# Altium schematic sheet Controle Moteurs.SchDoc
size A4
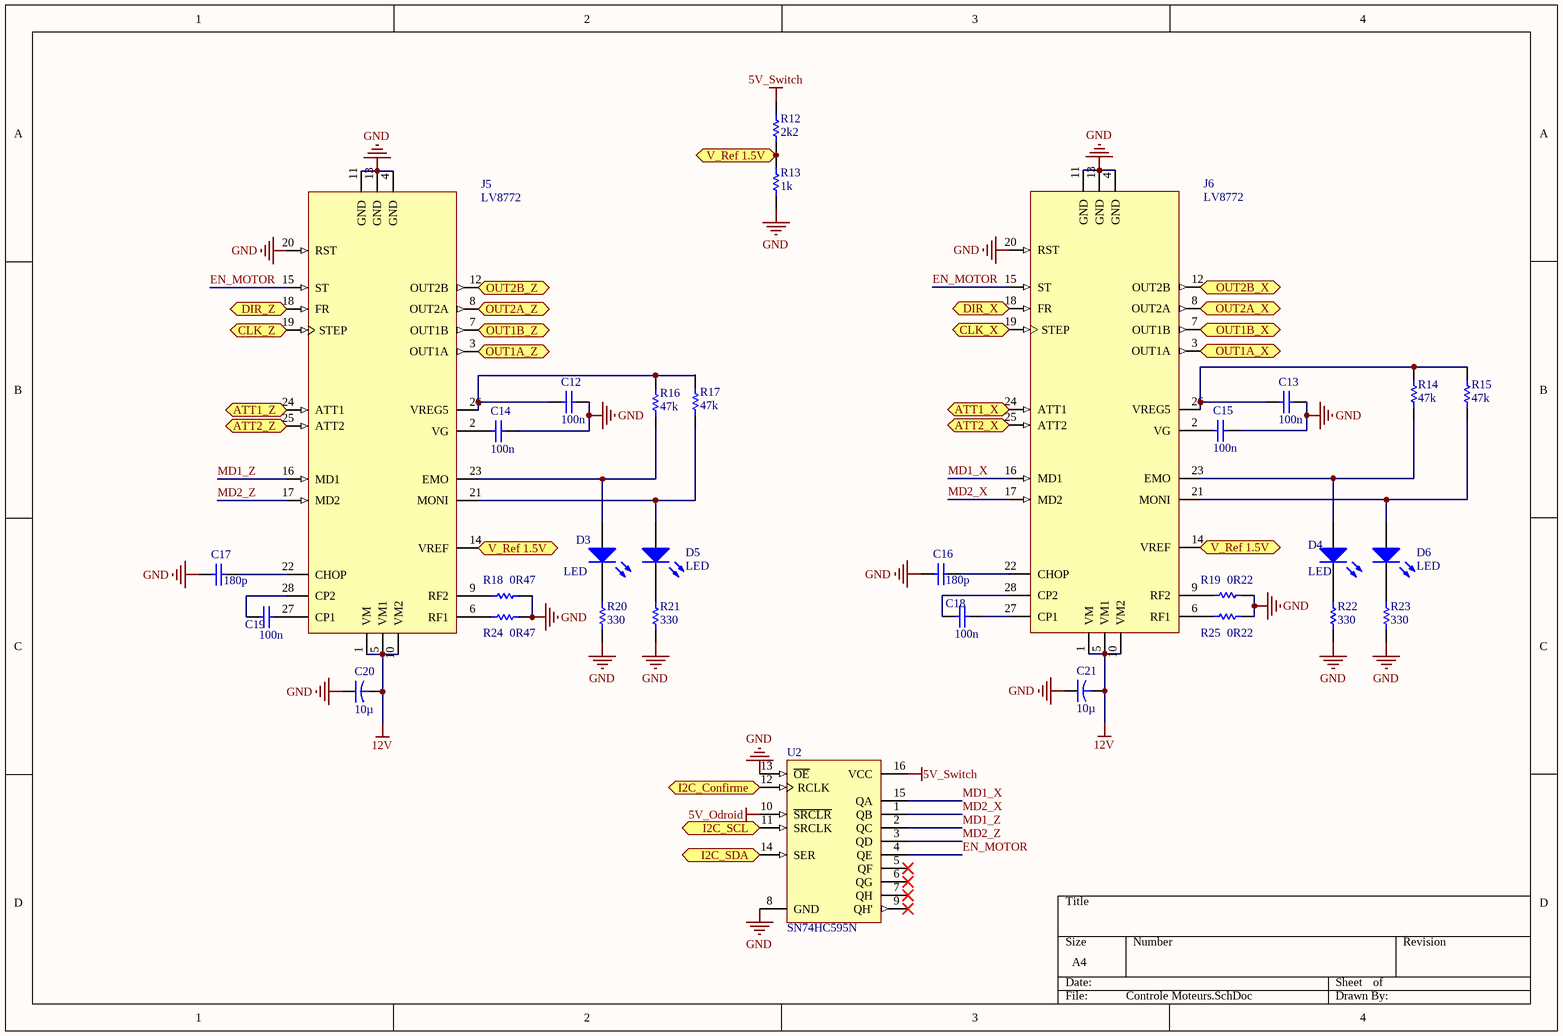
[diagram p0: Controle Moteurs.SchDoc]

## Parts
C12  value 100n  [0805]  (hidden comment: Cap)
C13  value 100n  [0805]  (hidden comment: Cap)
C14  value 100n  [0805]  (hidden comment: Cap)
C15  value 100n  [0805]  (hidden comment: Cap)
C16  value 180p  [0805]  (hidden comment: Cap)
C17  value 180p  [0805]  (hidden comment: Cap)
C18  value 100n  [0805]  (hidden comment: Cap)
C19  value 100n  [0805]  (hidden comment: Cap)
C20  value 10µ  [CAPR5-4X5]  (hidden comment: Cap2)
C21  value 10µ  [CAPR5-4X5]  (hidden comment: Cap2)
D3  LED  [C0805]
D4  LED  [C0805]
D5  LED  [C0805]
D6  LED  [C0805]
J5  LV8772  [DIP-28/P1.78]
J6  LV8772  [DIP-28/P1.78]
R12  value 2k2  [0805]  (hidden comment: Res*)
R13  value 1k  [0805]  (hidden comment: Res*)
R14  value 47k  [0805]  (hidden comment: Res*)
R15  value 47k  [0805]  (hidden comment: Res*)
R16  value 47k  [0805]  (hidden comment: Res*)
R17  value 47k  [0805]  (hidden comment: Res*)
R18  value 0R47  [0805]  (hidden comment: Res*)
R19  value 0R22  [0805]  (hidden comment: Res*)
R20  value 330  [0805]  (hidden comment: Res*)
R21  value 330  [0805]  (hidden comment: Res*)
R22  value 330  [0805]  (hidden comment: Res*)
R23  value 330  [0805]  (hidden comment: Res*)
R24  value 0R47  [0805]  (hidden comment: Res*)
R25  value 0R22  [0805]  (hidden comment: Res*)
U2  SN74HC595N  [SOIC-SO16_M]

## Ports
ATT1_X, ATT1_Z, ATT2_X, ATT2_Z, CLK_X, CLK_Z, DIR_X, DIR_Z, I2C_Confirme, I2C_SCL, I2C_SDA, OUT1A_X, OUT1A_Z, OUT1B_X, OUT1B_Z, OUT2A_X, OUT2A_Z, OUT2B_X, OUT2B_Z, V_Ref 1.5V

## Nets
5V_Odroid: U2.10(~{SRCLR})
5V_Switch: R12.1 U2.16(VCC)
12V: C20.2 C21.2 J5.1(VM) J5.5(VM1) J5.10(VM2) J6.1(VM) J6.5(VM1) J6.10(VM2)
GND: C12.2 C13.2 C14.1 C15.1 C16.2 C17.2 C20.1 C21.1 J5.4(GND) J5.11(GND) J5.13(GND) J5.20(RST) J6.4(GND) J6.11(GND) J6.13(GND) J6.20(RST) R13.2 R18.1 R19.1 R20.2 R21.2 R22.2 R23.2 R24.1 R25.1 U2.8(GND) U2.13(~{OE})
ATT1_X: J6.24(ATT1) ; port ATT1_X
ATT1_Z: J5.24(ATT1) ; port ATT1_Z
ATT2_X: J6.25(ATT2) ; port ATT2_X
ATT2_Z: J5.25(ATT2) ; port ATT2_Z
CLK_X: J6.19(STEP) ; port CLK_X
CLK_Z: J5.19(STEP) ; port CLK_Z
DIR_X: J6.18(FR) ; port DIR_X
DIR_Z: J5.18(FR) ; port DIR_Z
EN_MOTOR: J5.15(ST) J6.15(ST) U2.4(QE)
I2C_Confirme: U2.12(RCLK) ; port I2C_Confirme
I2C_SCL: U2.11(SRCLK) ; port I2C_SCL
I2C_SDA: U2.14(SER) ; port I2C_SDA
MD1_X: J6.16(MD1) U2.15(QA)
MD1_Z: J5.16(MD1) U2.2(QC)
MD2_X: J6.17(MD2) U2.1(QB)
MD2_Z: J5.17(MD2) U2.3(QD)
OUT1A_X: J6.3(OUT1A) ; port OUT1A_X
OUT1A_Z: J5.3(OUT1A) ; port OUT1A_Z
OUT1B_X: J6.7(OUT1B) ; port OUT1B_X
OUT1B_Z: J5.7(OUT1B) ; port OUT1B_Z
OUT2A_X: J6.8(OUT2A) ; port OUT2A_X
OUT2A_Z: J5.8(OUT2A) ; port OUT2A_Z
OUT2B_X: J6.12(OUT2B) ; port OUT2B_X
OUT2B_Z: J5.12(OUT2B) ; port OUT2B_Z
V_Ref 1.5V: J5.14(VREF) J6.14(VREF) R12.2 R13.1 ; port V_Ref 1.5V
NetC12_1: C12.1 J5.26(VREG5) R16.1 R17.1
NetC13_1: C13.1 J6.26(VREG5) R14.1 R15.1
NetC14_2: C14.2 J5.2(VG)
NetC15_2: C15.2 J6.2(VG)
NetC16_1: C16.1 J6.22(CHOP)
NetC17_1: C17.1 J5.22(CHOP)
NetC18_1: C18.1 J6.27(CP1)
NetC18_2: C18.2 J6.28(CP2)
NetC19_1: C19.1 J5.27(CP1)
NetC19_2: C19.2 J5.28(CP2)
NetD3_1: D3.1(A) J5.23(EMO) R16.2
NetD3_2: D3.2(K) R20.1
NetD4_1: D4.1(A) J6.23(EMO) R14.2
NetD4_2: D4.2(K) R22.1
NetD5_1: D5.1(A) J5.21(MONI) R17.2
NetD5_2: D5.2(K) R21.1
NetD6_1: D6.1(A) J6.21(MONI) R15.2
NetD6_2: D6.2(K) R23.1
NetJ5_6: J5.6(RF1) R24.2
NetJ5_9: J5.9(RF2) R18.2
NetJ6_6: J6.6(RF1) R25.2
NetJ6_9: J6.9(RF2) R19.2

Not connected (* = marked no-connect by the designer): U2 5(QF)* 6(QG)* 7(QH)* 9(QH')*

## Library data of the parts
C12-C15 C18 C19 = Cap: 100n; Published: 8-Jun-2000; LatestRevisionDate: 17-Jul-2002; LatestRevisionNote: Re-released for DXP Platform.; PackageReference: RAD-0.3; Publisher: Altium Limited
C16 C17 = Cap: 180p; Published: 8-Jun-2000; LatestRevisionDate: 17-Jul-2002; LatestRevisionNote: Re-released for DXP Platform.; PackageReference: RAD-0.3; Publisher: Altium Limited
C20 C21 = Cap2: 10µ; Published: 23-Sep-2002; PackageReference: CAPR5-4X5; Publisher: Altium Limited
D3-D6 = LED1: LED Rouge; Published: 8-Jun-2000; LatestRevisionDate: 08-Jul-2005; LatestRevisionNote: Mech Layer 1 removed.; PackageReference: LED-1; Publisher: Altium Limited
J5 J6 = LV8772: Driver Pas à Pas
R12 = Res1: 2.2k; Published: 8-Jun-2000; LatestRevisionDate: 17-Jul-2002; LatestRevisionNote: Re-released for DXP Platform.; PackageReference: 0805; Publisher: Altium Limited
R13 = Res1: 1k; Published: 8-Jun-2000; LatestRevisionDate: 17-Jul-2002; LatestRevisionNote: Re-released for DXP Platform.; PackageReference: 0805; Publisher: Altium Limited
R14-R17 = Res1: 47k; Published: 8-Jun-2000; LatestRevisionDate: 17-Jul-2002; LatestRevisionNote: Re-released for DXP Platform.; Publisher: Altium Limited
  R14-R16: PackageReference: AXIAL-0.3
  R17: PackageReference: 0805
R18 R24 = Res1: 470m; Published: 8-Jun-2000; LatestRevisionDate: 17-Jul-2002; LatestRevisionNote: Re-released for DXP Platform.; PackageReference: AXIAL-0.3; Publisher: Altium Limited
R19 R25 = Res1: 220m; Published: 8-Jun-2000; LatestRevisionDate: 17-Jul-2002; LatestRevisionNote: Re-released for DXP Platform.; PackageReference: AXIAL-0.3; Publisher: Altium Limited
R20-R23 = Res1: 330R; Published: 8-Jun-2000; LatestRevisionDate: 17-Jul-2002; LatestRevisionNote: Re-released for DXP Platform.; PackageReference: AXIAL-0.3; Publisher: Altium Limited
U2 = SN74HC595N: 8-Bit Shift Register with 3-State Output Registers; Published: 8-Jun-2000; LatestRevisionDate: 04-Mar-2005; LatestRevisionNote: Stylized 3D Model Added.; DatasheetVersion: May-1997; PackageVersion: Oct-1995; PackageReference: N016; Publisher: Altium Limited; PackageDescription: DIP; 16 Leads; Row Spacing 7.62 mm; Pitch 2.54 mm; Code_JEDEC: MS-001-BB; ComponentLink1Description: Manufacturer Link; ComponentLink1URL: http://www.ti.com/; ComponentLink2Description: Datasheet; ComponentLink2URL: http://www-s.ti.com/sc/ds/sn74hc595.pdf